# Altium schematic sheet servo.SchDoc
size 420 x 297 mm; Organization: Yandex; Address2: 11 Timura Frunze st., building 2; SheetNumber: 3; SheetTotal: 8; Document_Status: Draft; Language: en; Organization2: Self Driving Group LLC
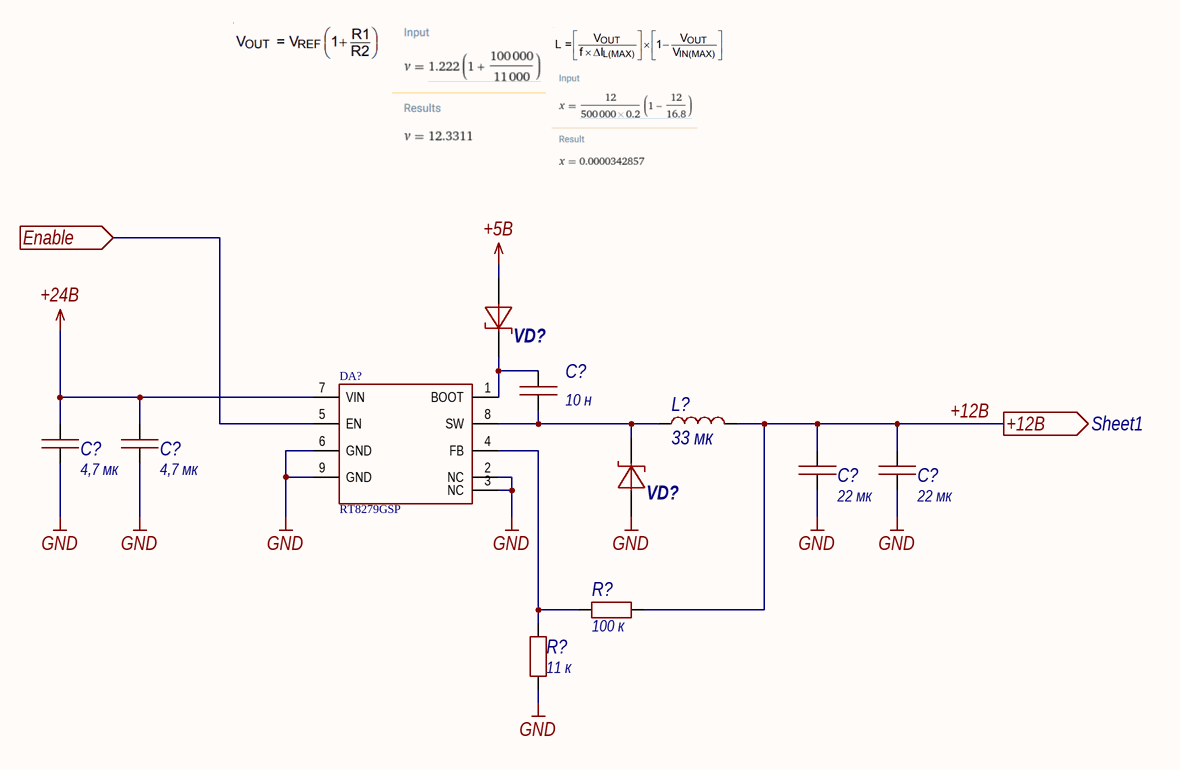
[diagram p0: servo.SchDoc]

## Parts
(Parts that share a designator on the sheet are numbered #1, #2 ... from top to bottom, then left to right.)
C?#1  value 10 н  [0603C]  (hidden comment: Capacitor)
C?#2  value 4,7 мк  [1206C]  (hidden comment: Capacitor)
C?#3  value 4,7 мк  [1206C]  (hidden comment: Capacitor)
C?#4  value 22 мк  [1210C]  (hidden comment: Capacitor)
C?#5  value 22 мк  [1210C]  (hidden comment: Capacitor)
DA?  RT8279GSP  [8SOP(Exposed_Pad)]
L?  value 33 мк  [IHLP-4040]  (hidden comment: IHLP4040DZER330M11)
R?#1  value 100 к  [0603R]  (hidden comment: Resistor)
R?#2  value 11 к  [0603R]  (hidden comment: Resistor)
VD?#1  BAT54WS  [SOD-323]  (value not drawn)
VD?#2  10S45SP  [TO-277]  (value not drawn)

## Ports
+12В (out, see Sheet1), Enable (in)

## Nets
+5В: VD?#1.1
+24В: C?#2.2 C?#3.2 DA?.7(VIN)
GND: C?#2.1 C?#3.1 C?#4.1 C?#5.1 DA?.2(NC) DA?.3(NC) DA?.6(GND) DA?.9(GND) R?#2.1 VD?#2.1
+12В: C?#4.2 C?#5.2 L?.2 R?#1.2 ; port +12В
Enable: DA?.5(EN) ; port Enable
NetC?#1_1: C?#1.1 DA?.8(SW) L?.1 VD?#2.2
NetC?#1_2: C?#1.2 DA?.1(BOOT) VD?#1.2
NetDA?_4: DA?.4(FB) R?#1.1 R?#2.2

## Notes on the sheet
- Перв. примен.
- Справ. №
- Подп. и дата
- Инв. № дубл.
- Взам. инв. №
- Инв. № подл.
- Изм.
- Лист
- № докум.
- Подп.
- Дата
- Копировал
- Формат А3

## Library data of the parts
C?#1 = Capacitor_10n_10_50V_X7R_0603C: Конденсатор; Library Path2: Schematic\Capacitor.SchLib; Tolerance: 0,1; Voltage (V): 50; Dielectric: X7R; Capacity (nF): 10; Part Number: Capacitor_10n_10_50V_X7R_0603C
C?#2 C?#3 = Capacitor_4,7u_10_50V_X7R_1206C: Конденсатор; Library Path2: Schematic\Capacitor.SchLib; Tolerance: 0,1; Voltage (V): 50; Dielectric: X7R; Capacity (nF): 4700; Part Number: Capacitor_4,7u_10_50V_X7R_1206C
C?#4 C?#5 = Capacitor_22u_10_25V_X7R_1210C: Конденсатор; Library Path2: Schematic\Capacitor.SchLib; Tolerance: 0,1; Voltage (V): 25; Dielectric: X7R; Capacity (nF): 22000; Part Number: Capacitor_22u_10_25V_X7R_1210C
DA? = RT8279GSP: Преобразователь постоянного тока понижающий подстраиваемый выход 5А; Part Number: RT8279GSP
L? = IHLP4040DZER330M11: ЧИП-индуктивность экранированная 33мкГн ±20% 4,4A 94,5мОм 4040; Inductance (μH): 33; Current (A): 4,4; Part Number: IHLP4040DZER330M11
R?#1 = Resistor_100k_1_0603: Резистор номиналом 100 кОм и точностью 1%; Power: *; Part Number: Resistor_100k_1_0603; Tolerance: 1%
R?#2 = Resistor_11k_1_0603: Резистор номиналом 11 кОм и точностью 1%; Power: *; Part Number: Resistor_11k_1_0603; Tolerance: 1%
VD?#1 = BAT54WS: Диод шоттки на 30 В, ном. ток 0.2 А; Voltage nominal (V): 30; Current (A): 0.2; Part Number: BAT54WS
VD?#2 = 10S45SP: Диод шоттки на 45 В, ном. ток 10 А; Voltage nominal (V): 45; Current (A): 10; Part Number: 10S45SP